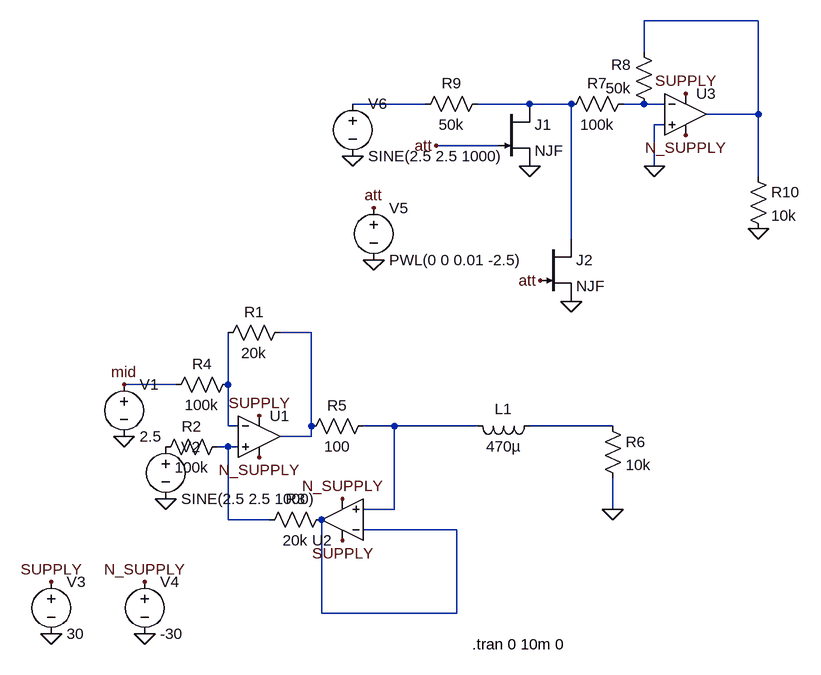
[diagram p0: schematic Current_Source.asc]
Current_Source.asc, the LTspice schematic file:
Version 4
SHEET 1 1140 680
WIRE 944 -560 768 -560
WIRE 768 -512 768 -560
WIRE 432 -432 320 -432
WIRE 592 -432 512 -432
WIRE 656 -432 592 -432
WIRE 768 -432 736 -432
WIRE 800 -432 768 -432
WIRE 944 -416 944 -560
WIRE 944 -416 864 -416
WIRE 800 -400 784 -400
WIRE 544 -368 448 -368
WIRE 784 -336 784 -400
WIRE 944 -320 944 -416
WIRE 656 -224 656 -432
WIRE 256 -80 208 -80
WIRE 48 0 -32 0
WIRE 128 0 128 -80
WIRE 128 64 128 0
WIRE 144 64 128 64
WIRE 256 64 256 -80
WIRE 384 64 336 64
WIRE 512 64 384 64
WIRE 720 64 592 64
WIRE 256 80 256 64
WIRE 256 80 208 80
WIRE 128 96 112 96
WIRE 144 96 128 96
WIRE 384 192 384 64
WIRE 384 192 336 192
WIRE 720 192 720 144
WIRE 128 208 128 96
WIRE 192 208 128 208
WIRE 480 224 336 224
WIRE 272 352 272 208
WIRE 480 352 480 224
WIRE 480 352 272 352
FLAG 720 192 0
FLAG -32 80 0
FLAG 32 176 0
FLAG -144 384 0
FLAG -144 304 SUPPLY
FLAG 304 240 SUPPLY
FLAG 176 48 SUPPLY
FLAG 0 384 0
FLAG 176 112 N_SUPPLY
FLAG 304 176 N_SUPPLY
FLAG 0 304 N_SUPPLY
FLAG 832 -384 N_SUPPLY
FLAG 832 -448 SUPPLY
FLAG 352 -192 0
FLAG 320 -352 0
FLAG 944 -240 0
FLAG 784 -336 0
FLAG 352 -272 att
FLAG 448 -368 att
FLAG 608 -160 att
FLAG -32 0 mid
FLAG 656 -128 0
FLAG 592 -336 0
SYMBOL OpAmps\\UniversalOpAmp 176 80 R0
SYMATTR InstName U1
SYMBOL OpAmps\\UniversalOpAmp 304 208 R180
SYMATTR InstName U2
SYMBOL res 224 -96 R90
WINDOW 0 0 56 VBottom 2
WINDOW 3 32 56 VTop 2
SYMATTR InstName R1
SYMATTR Value 20k
SYMBOL res 128 80 R90
WINDOW 0 0 56 VBottom 2
WINDOW 3 32 56 VTop 2
SYMATTR InstName R2
SYMATTR Value 100k
SYMBOL res 288 192 R90
WINDOW 0 0 56 VBottom 2
WINDOW 3 32 56 VTop 2
SYMATTR InstName R3
SYMATTR Value 20k
SYMBOL res 144 -16 R90
WINDOW 0 0 56 VBottom 2
WINDOW 3 32 56 VTop 2
SYMATTR InstName R4
SYMATTR Value 100k
SYMBOL res 352 48 R90
WINDOW 0 0 56 VBottom 2
WINDOW 3 32 56 VTop 2
SYMATTR InstName R5
SYMATTR Value 100
SYMBOL res 704 48 R0
SYMATTR InstName R6
SYMATTR Value 10k
SYMBOL voltage -32 -16 R0
WINDOW 123 0 0 Left 0
WINDOW 39 0 0 Left 0
SYMATTR InstName V1
SYMATTR Value 2.5
SYMBOL voltage 32 80 R0
WINDOW 123 0 0 Left 0
WINDOW 39 0 0 Left 0
SYMATTR InstName V2
SYMATTR Value SINE(2.5 2.5 1000)
SYMBOL voltage -144 288 R0
WINDOW 123 0 0 Left 0
WINDOW 39 0 0 Left 0
SYMATTR InstName V3
SYMATTR Value 30
SYMBOL voltage 0 288 R0
WINDOW 123 0 0 Left 0
WINDOW 39 0 0 Left 0
SYMATTR InstName V4
SYMATTR Value -30
SYMBOL ind 608 48 R90
WINDOW 0 5 56 VBottom 2
WINDOW 3 32 56 VTop 2
SYMATTR InstName L1
SYMATTR Value 470µ
SYMBOL OpAmps\\UniversalOpAmp 832 -416 R0
SYMATTR InstName U3
SYMBOL res 640 -416 R270
WINDOW 0 32 56 VTop 2
WINDOW 3 0 56 VBottom 2
SYMATTR InstName R7
SYMATTR Value 100k
SYMBOL res 784 -416 R180
WINDOW 0 36 76 Left 2
WINDOW 3 36 40 Left 2
SYMATTR InstName R8
SYMATTR Value 50k
SYMBOL voltage 352 -288 R0
WINDOW 123 0 0 Left 0
WINDOW 39 0 0 Left 0
SYMATTR InstName V5
SYMATTR Value PWL(0 0 0.01 -2.5)
SYMBOL njf 544 -432 R0
SYMATTR InstName J1
SYMBOL voltage 320 -448 R0
WINDOW 123 0 0 Left 0
WINDOW 39 0 0 Left 0
SYMATTR InstName V6
SYMATTR Value SINE(2.5 2.5 1000)
SYMBOL res 528 -448 R90
WINDOW 0 0 56 VBottom 2
WINDOW 3 32 56 VTop 2
SYMATTR InstName R9
SYMATTR Value 50k
SYMBOL res 928 -336 R0
SYMATTR InstName R10
SYMATTR Value 10k
SYMBOL njf 608 -224 R0
SYMATTR InstName J2
TEXT 504 400 Left 2 !.tran 0 10m 0

The netlist it stands for:
* Current_Source.asc
XU1 N009 N006 SUPPLY N_SUPPLY N005 level1 Avol=1Meg GBW=10Meg Vos=0 En=0 Enk=0 In=0 Ink=0 Rin=500Meg  ; pins In+ In- V+ V- OUT
XU2 N007 N010 SUPPLY N_SUPPLY N010 level1 Avol=1Meg GBW=10Meg Vos=0 En=0 Enk=0 In=0 Ink=0 Rin=500Meg  ; pins In+ In- V+ V- OUT
R1 N005 N006 20k
R2 N009 P001 100k
R3 N010 N009 20k
R4 N006 mid 100k
R5 N007 N005 100
R6 N008 0 10k
V1 mid 0 2.5
V2 P001 0 SINE(2.5 2.5 1000)
V3 SUPPLY 0 30
V4 N_SUPPLY 0 -30
L1 N008 N007 470µ
XU3 0 N004 SUPPLY N_SUPPLY N001 level1 Avol=1Meg GBW=10Meg Vos=0 En=0 Enk=0 In=0 Ink=0 Rin=500Meg  ; pins In+ In- V+ V- OUT
R7 N003 N004 100k
R8 N004 N001 50k
V5 att 0 PWL(0 0 0.01 -2.5)
J1 N003 att 0 NJF
V6 N002 0 SINE(2.5 2.5 1000)
R9 N003 N002 50k
R10 N001 0 10k
J2 N003 att 0 NJF
.model NJF NJF
.model PJF PJF
.lib standard.jft
.tran 0 10m 0
.lib UniversalOpAmp1.lib
.backanno
.end